# EasyEDA Pro project ProPrj_承载我所有幻想的键盘_2025-02-09.epro, schematic 01-Schematic, sheets 5 to 8 of 8

## Sheets
5 USB: Create Date: 2024-07-29; Page Name: USB; Project Name: 火星号键盘V2; Schematic Name: 主控板_4; Update Date: 2024-07-29
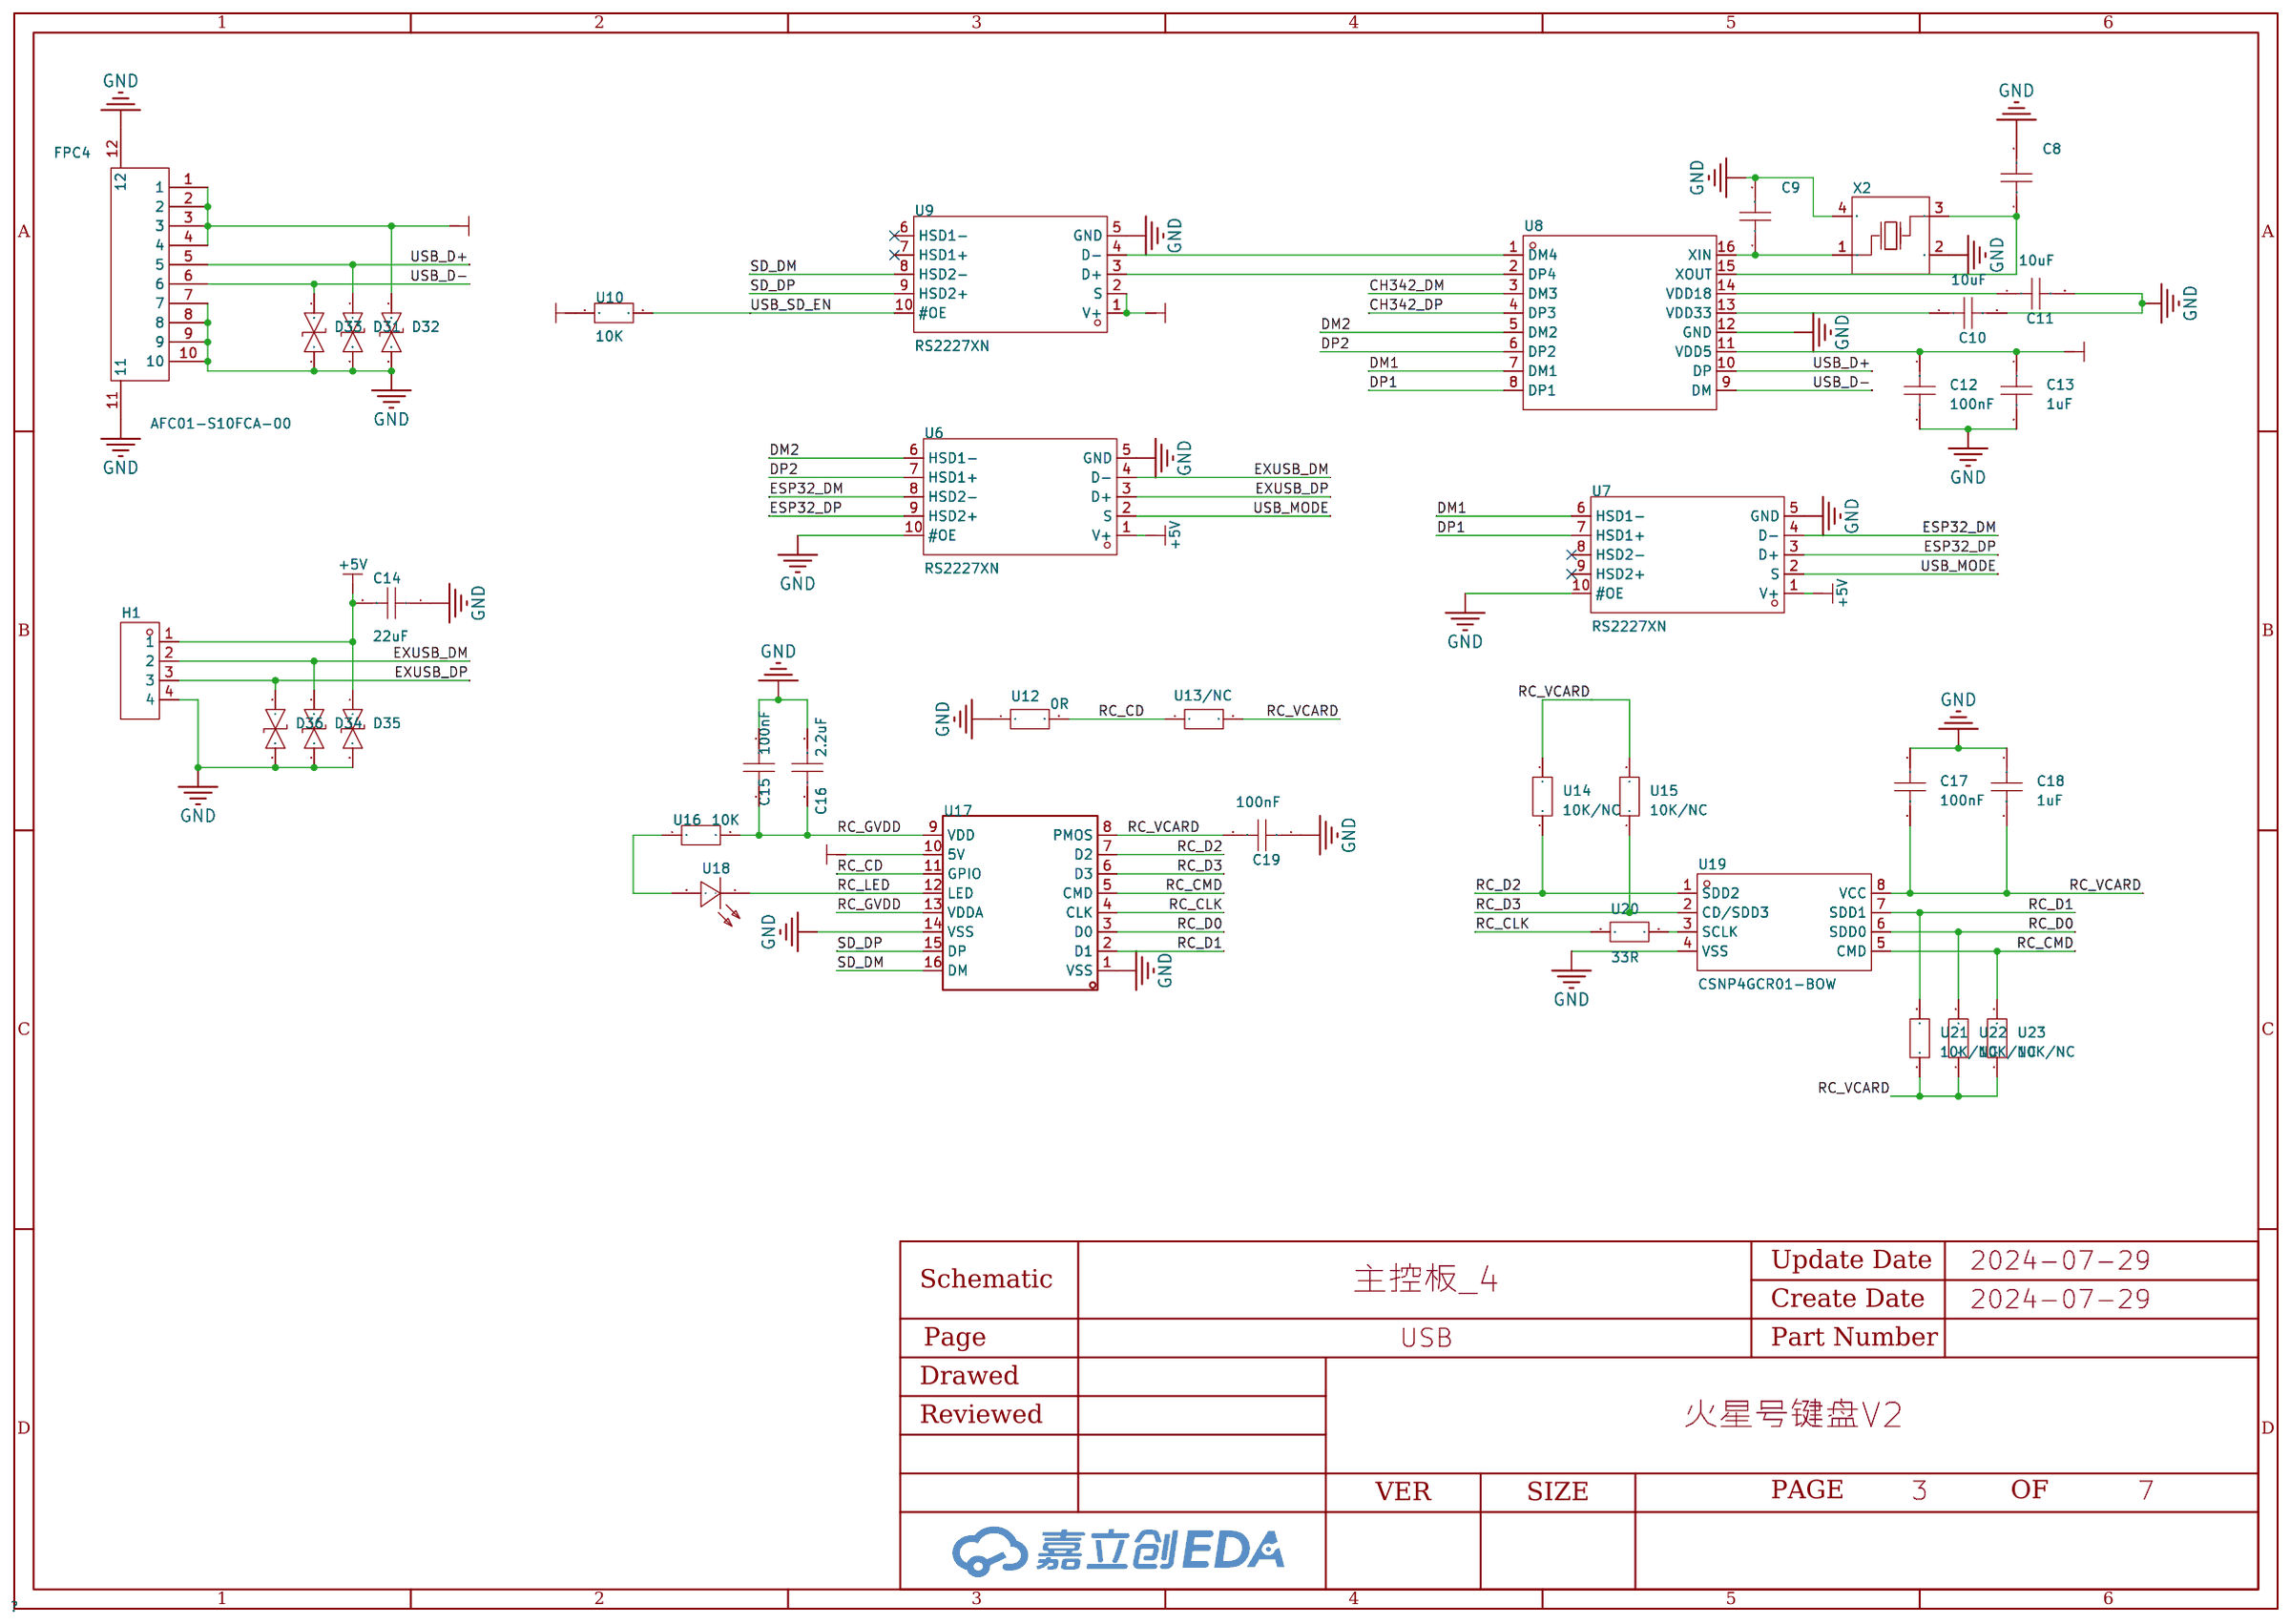
[diagram p4: USB]
6 电源: Create Date: 2024-07-29; Page Name: 电源; Project Name: 火星号键盘V2; Schematic Name: 主控板_4; Update Date: 2024-07-29
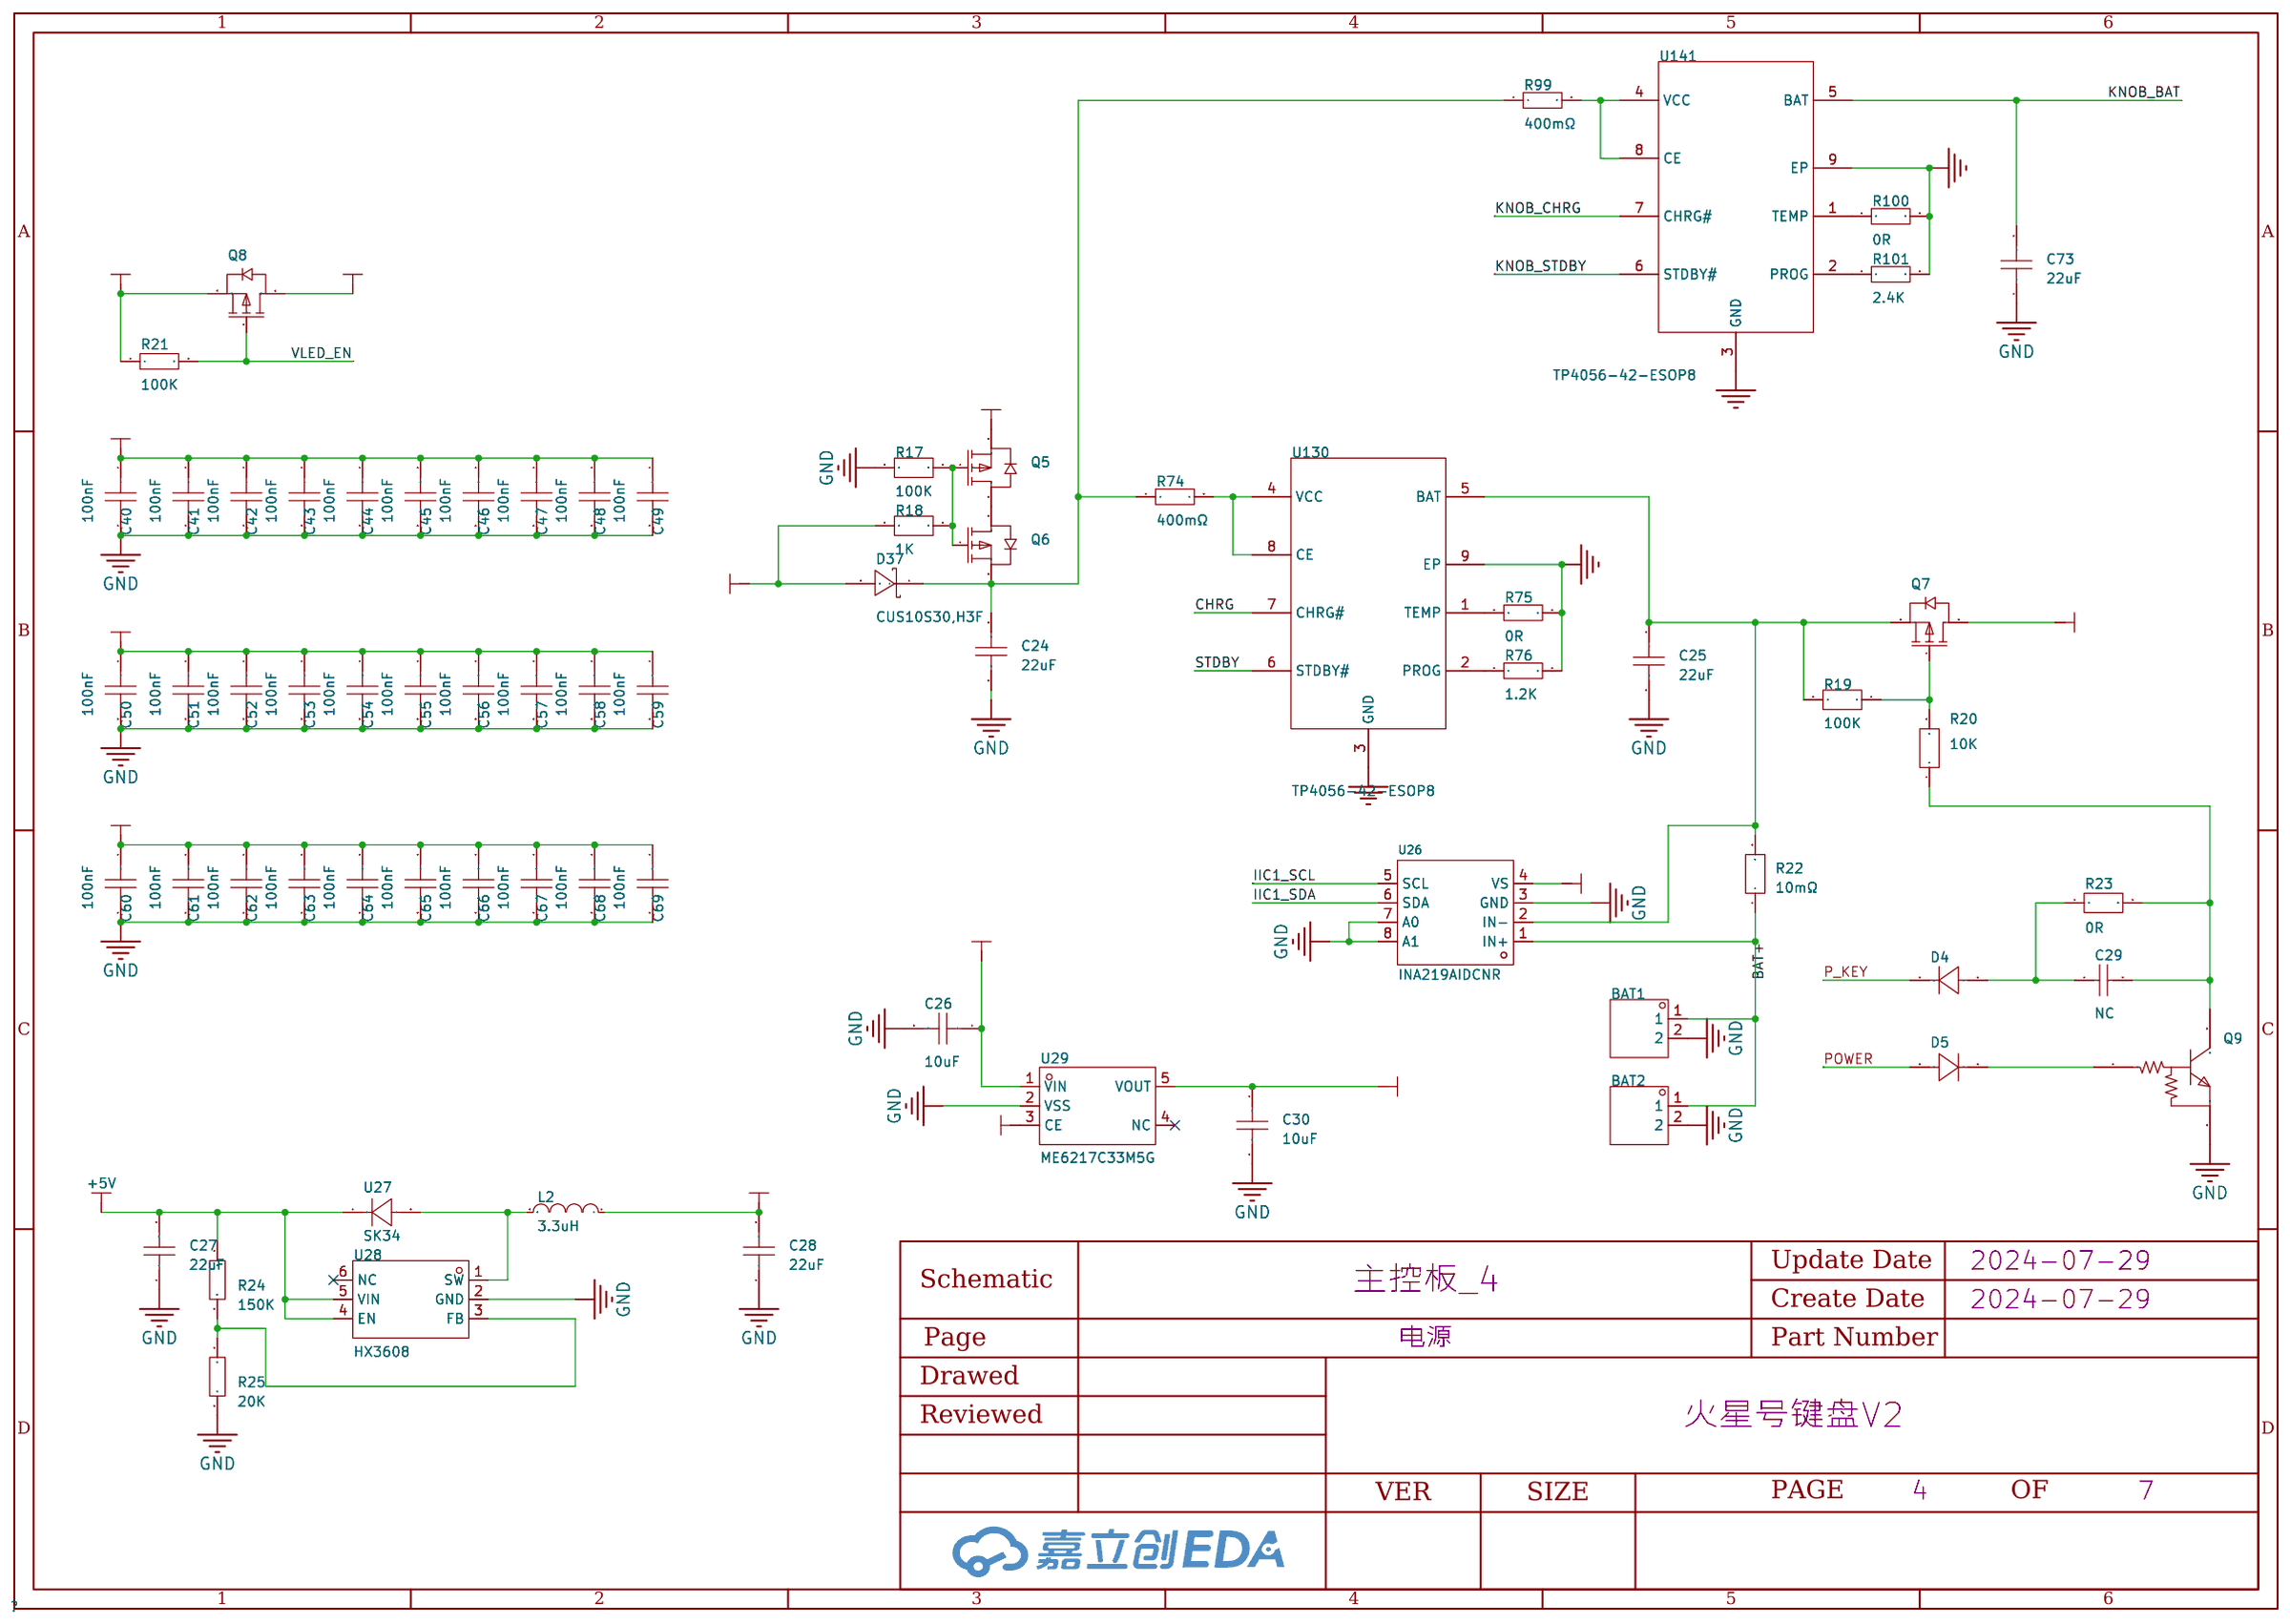
[diagram p5: 电源]
7 下载: Create Date: 2024-07-29; Page Name: 下载; Project Name: 火星号键盘V2; Schematic Name: 主控板_4; Update Date: 2024-07-29
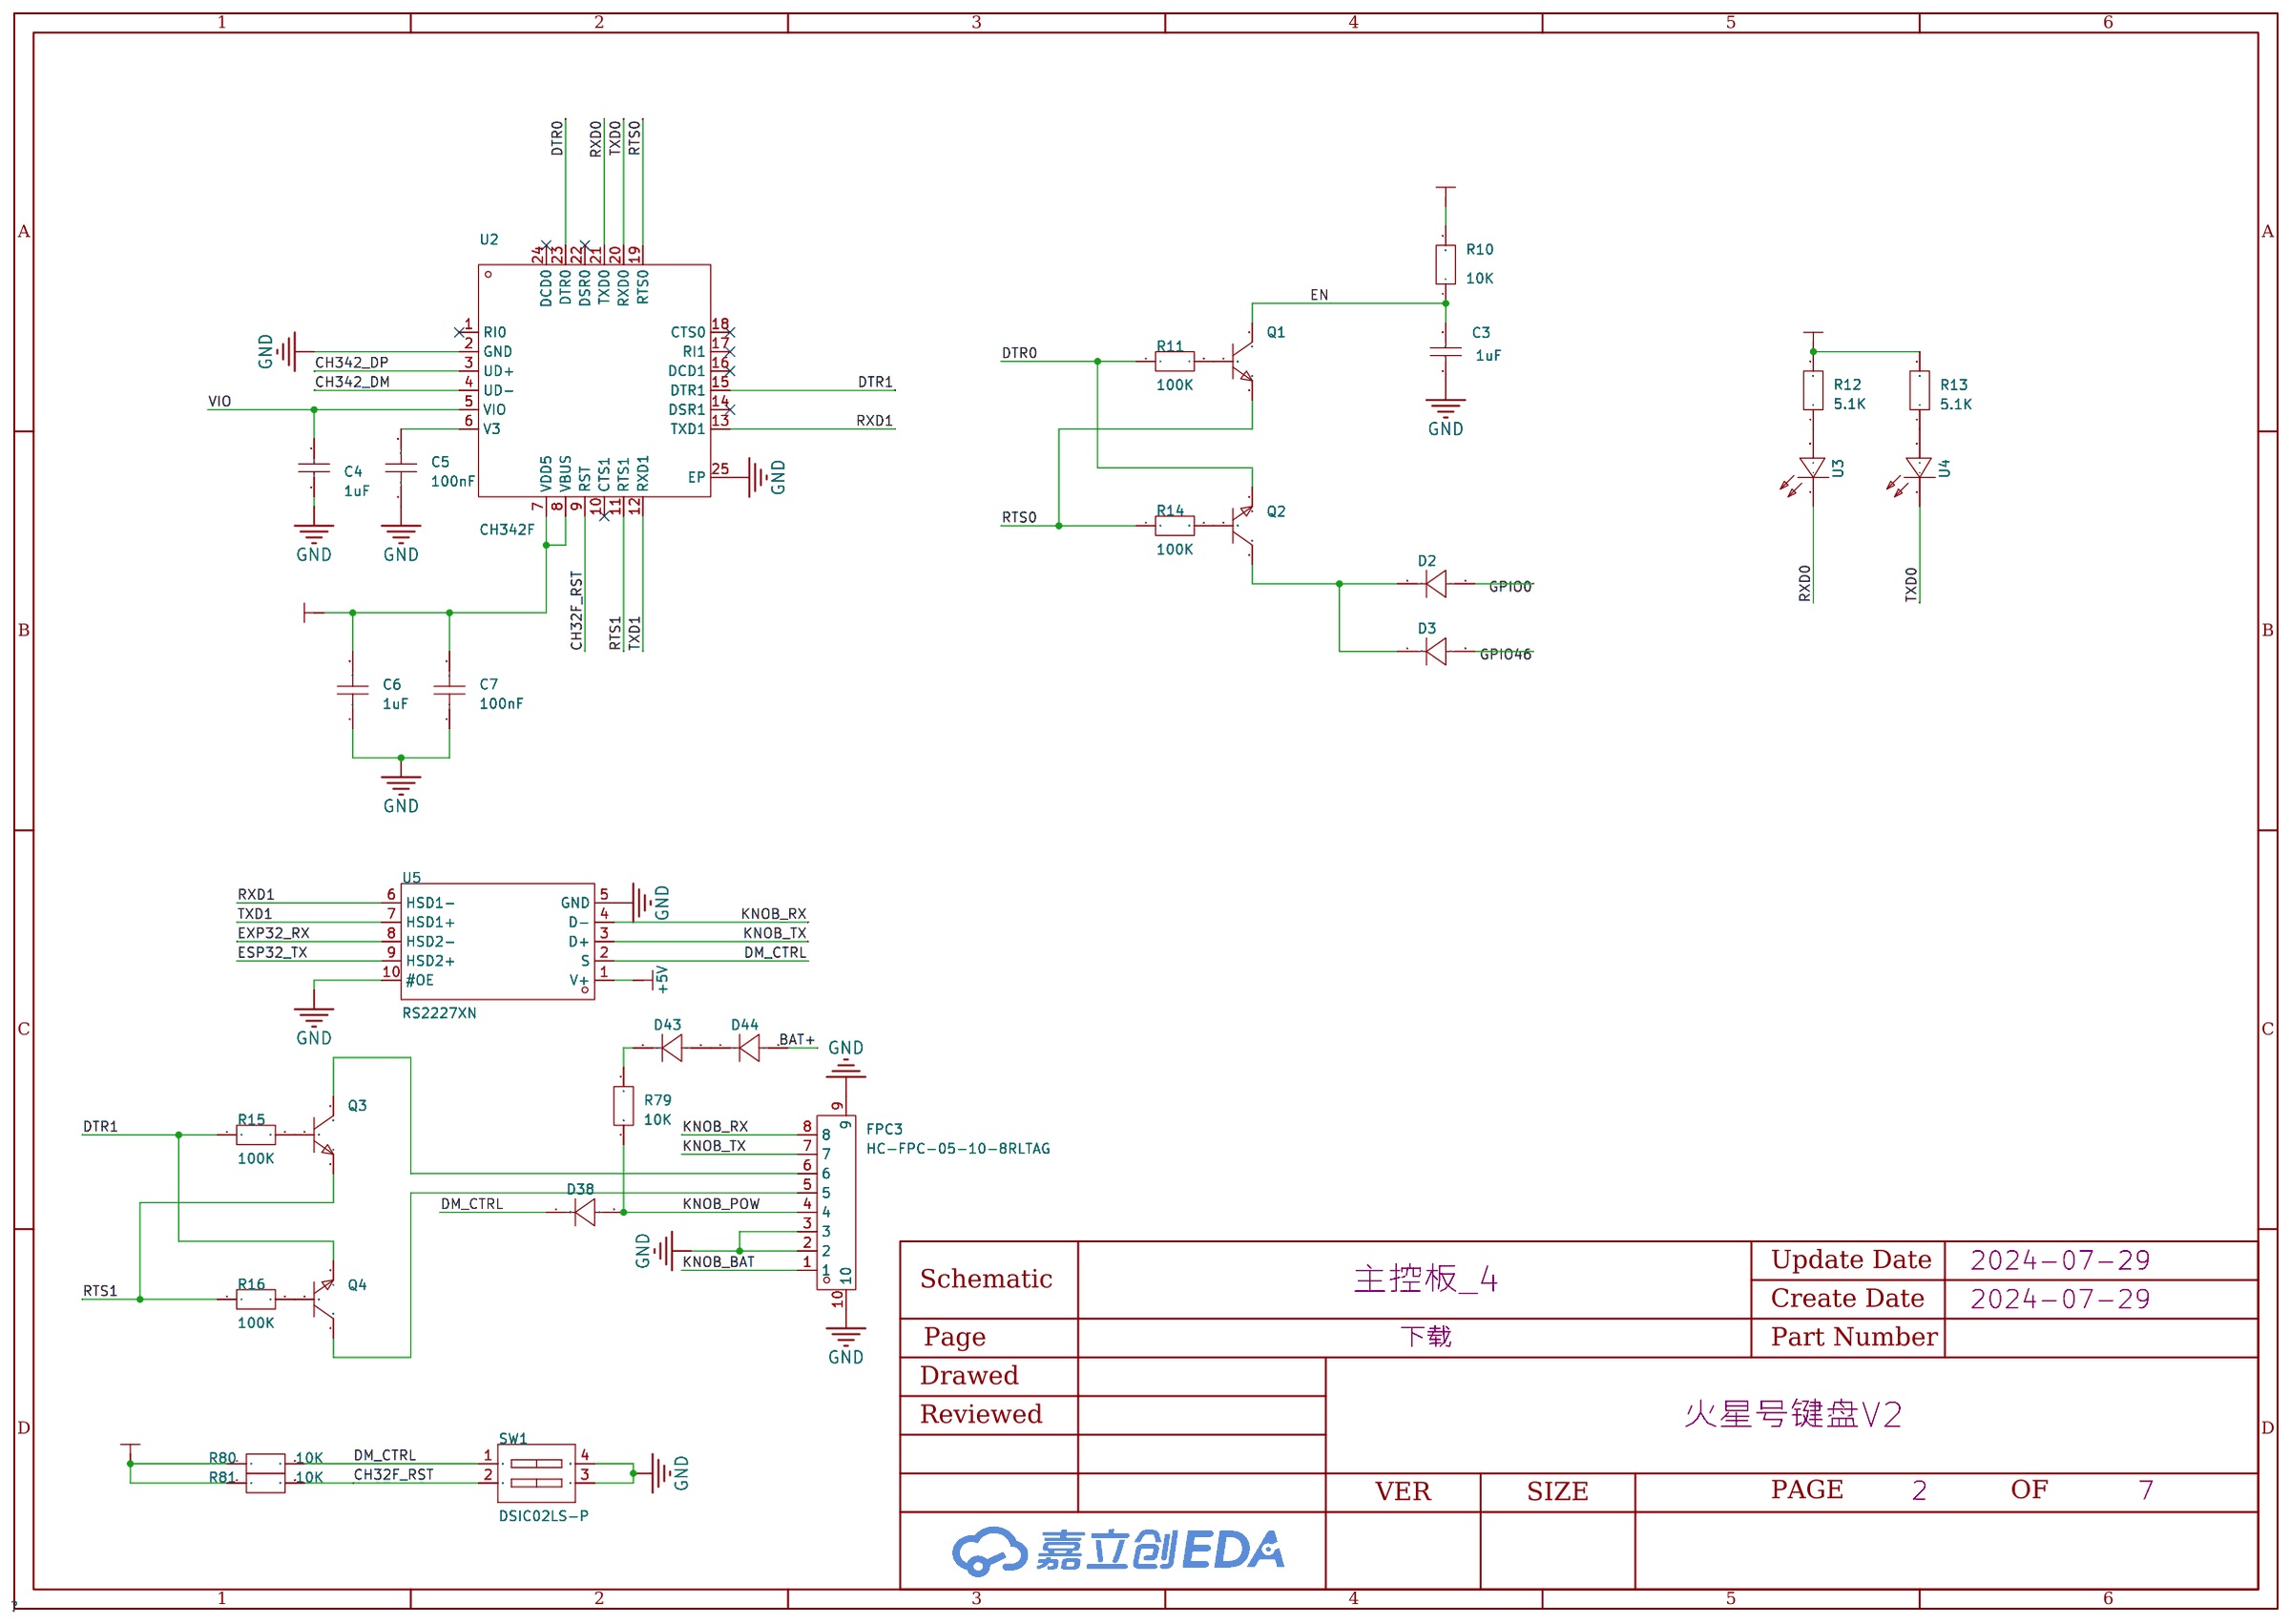
[diagram p6: 下载]
8 音频
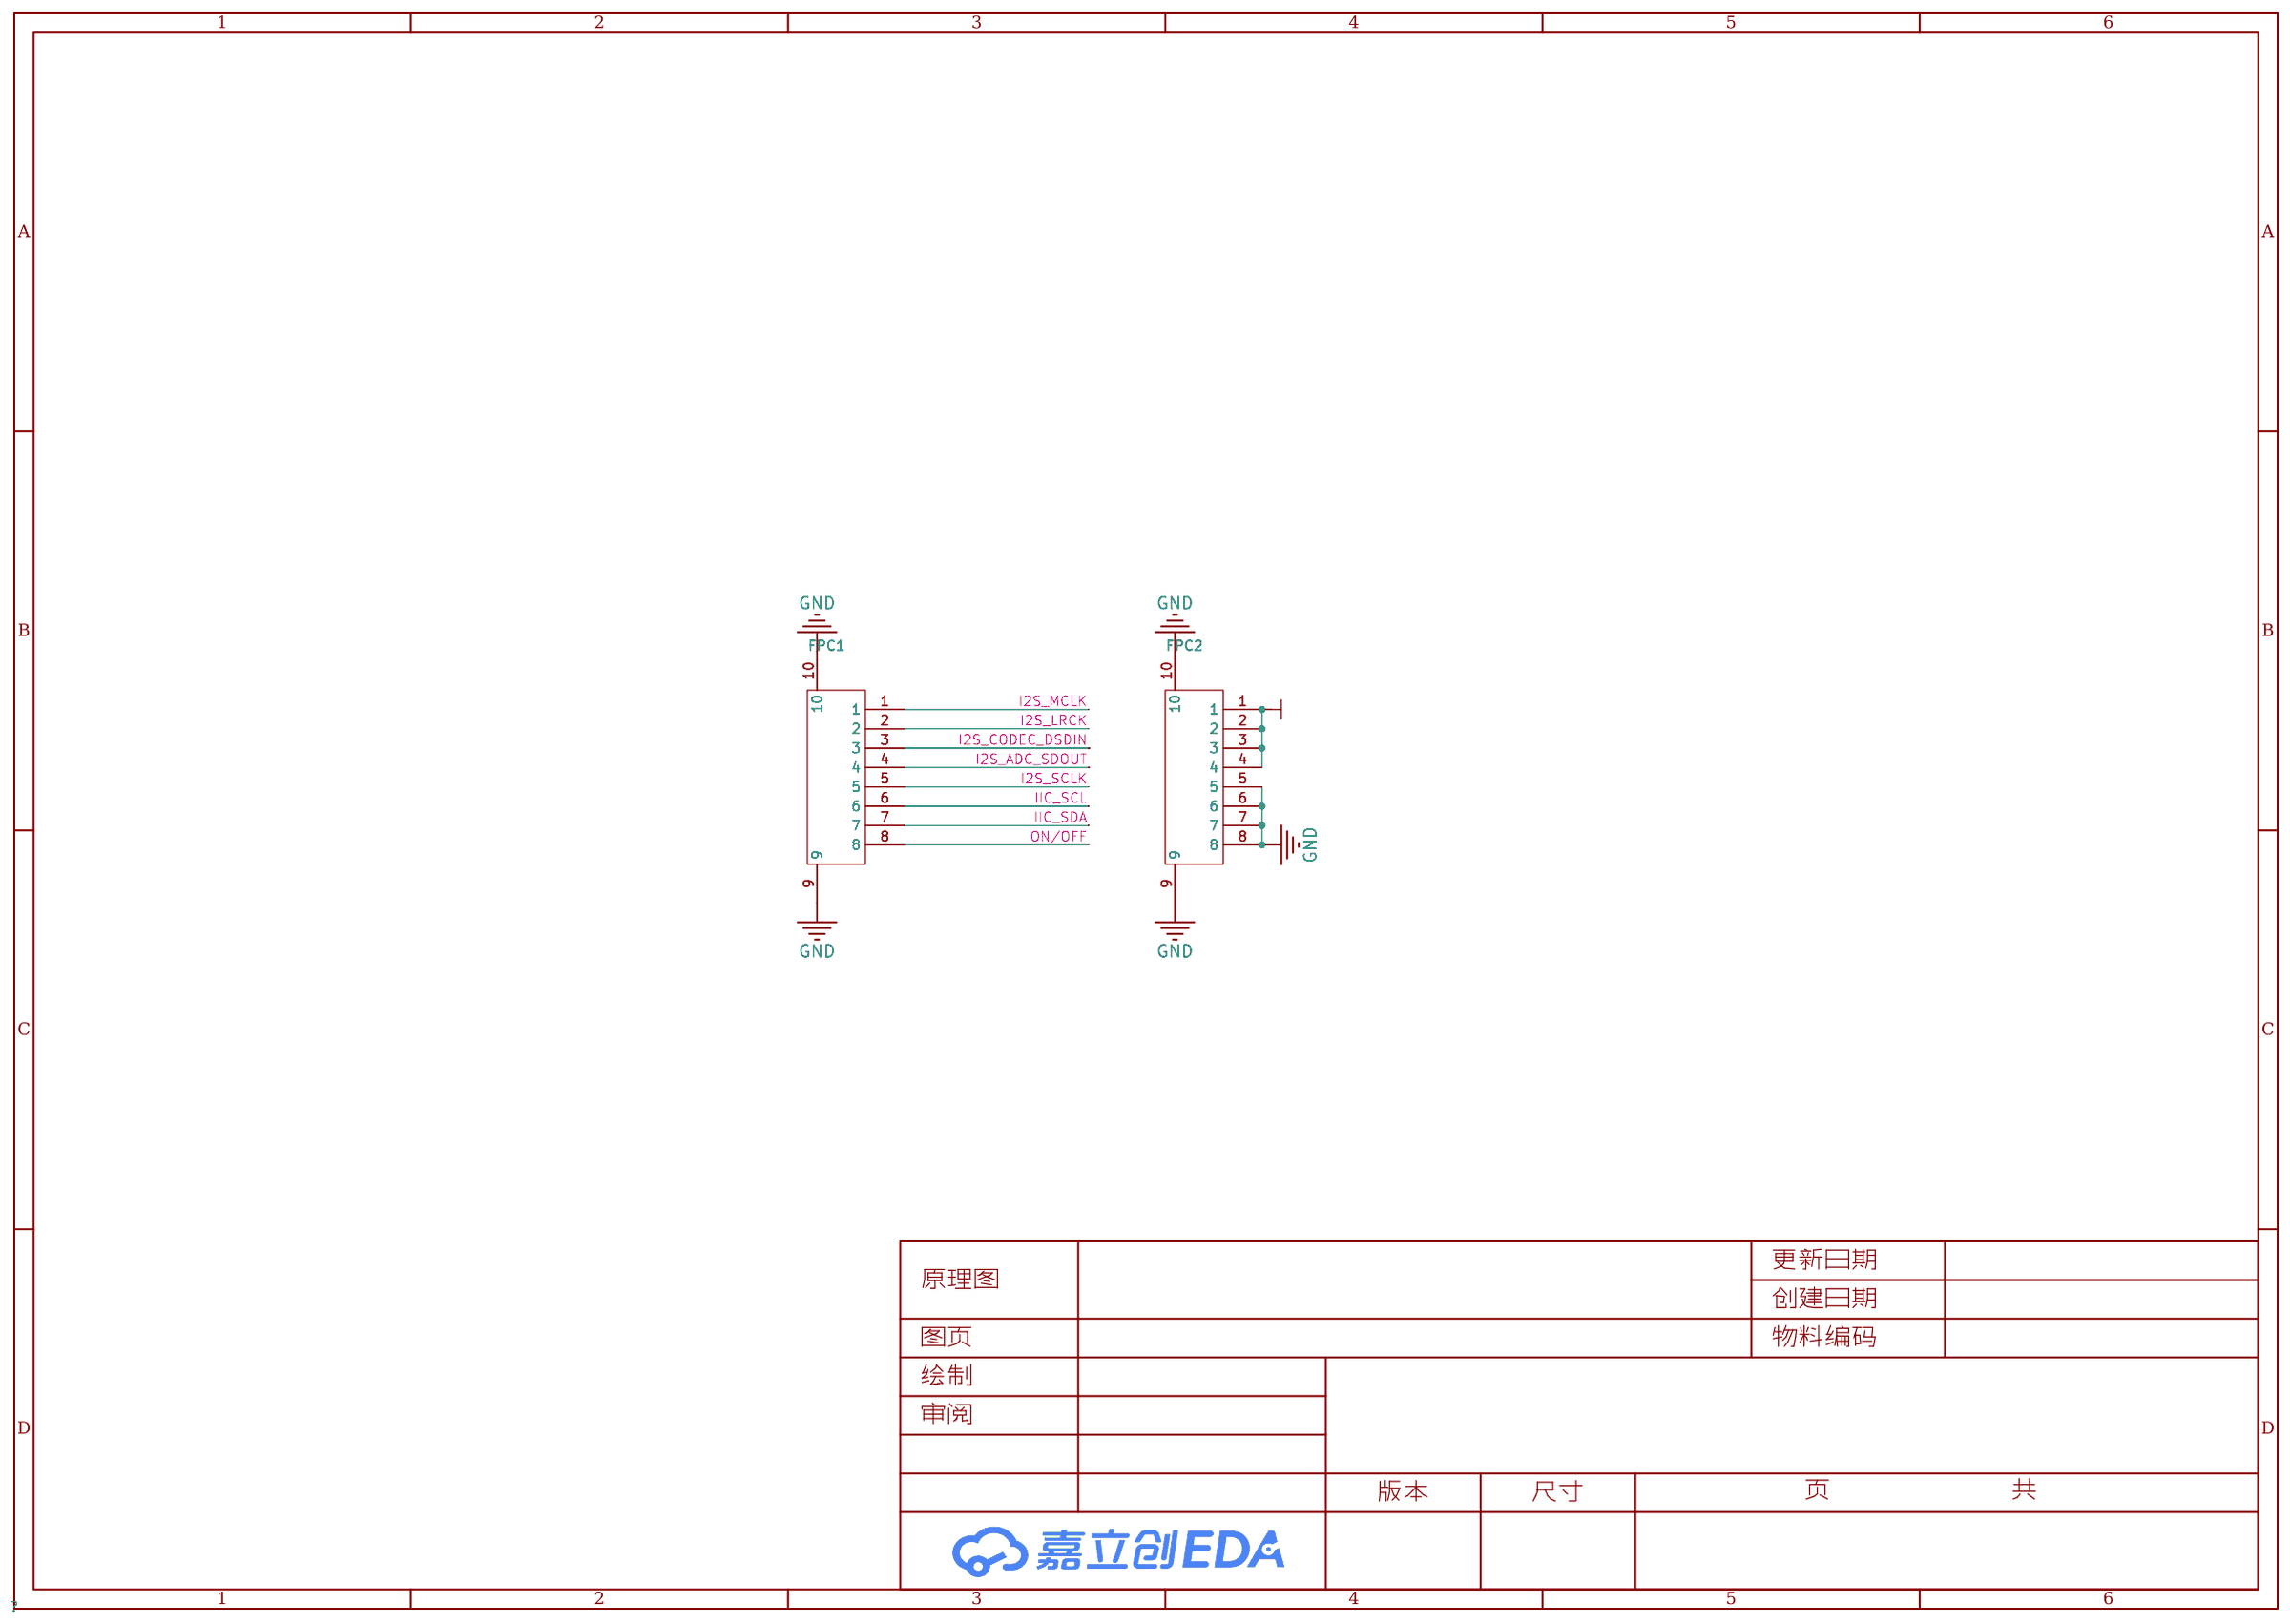
[diagram p7: 音频]

## Parts
sheet USB
C8  20pF  [C0402]
C9  20pF  [C0402]
C10  10uF  [C0402]
C11  10uF  [C0402]
C12  100nF  [C0402]
C13  100nF  [C0402]
C14  22uF  [C0805]
C15  100nF  [C0402]
C16  2.2uF  [C0402]
C17  100nF  [C0402]
C18  100nF  [C0402]
C19  100nF  [C0402]
D31  0603ESDA-05N  [D0603-BI]
D32  0603ESDA-05N  [D0603-BI]
D33  0603ESDA-05N  [D0603-BI]
D34  0603ESDA-05N  [D0603-BI]
D35  0603ESDA-05N  [D0603-BI]
D36  0603ESDA-05N  [D0603-BI]
FPC4  AFC01-S10FCA-00  [FPC-SMD_P0.5-10P_FGS-XJ-H2.0]
H1  -  [HDR-TH_4P-P2.54-V-M]
U6  RS2227XN  [MSOP-10_L3.0-W3.0-P0.50-LS5.0-BL]
U7  RS2227XN  [MSOP-10_L3.0-W3.0-P0.50-LS5.0-BL]
U8  SL2.1A  [SOP-16_L10.0-W3.9-P1.27-LS6.0-BL]
U9  RS2227XN  [MSOP-10_L3.0-W3.0-P0.50-LS5.0-BL]
U10  10K  [R0402]
U12  0R  [R0402]
U13/NC  10K  [R0402]
U14  10K/NC  [R0402]
U15  10K/NC  [R0402]
U16  10K  [R0402]
U17  GL823K  [SSOP-16_L4.9-W3.9-P0.64-LS6.0-BL]
U18  SML-LX0603SRW-TR  [LED0603-RD_RED]
U19  CSNP4GCR01-BOW  [LGA-8_L6.0-W8.0-P1.27-TL]
U20  33R  [R0402]
U21  10K/NC  [R0402]
U22  10K/NC  [R0402]
U23  10K/NC  [R0402]
X2  12MHz  [CRYSTAL-SMD_4P-L3.2-W2.5-BL]
sheet 下载
C3  1uF  [C0402]
C4  1uF  [C0402]
C5  100nF  [C0402]
C6  100nF  [C0402]
C7  100nF  [C0402]
D2  1N4148WS  [SOD-323_L1.8-W1.3-LS2.5-RD]
D3  1N4148WS  [SOD-323_L1.8-W1.3-LS2.5-RD]
D38  1N4148WS  [SOD-323_L1.8-W1.3-LS2.5-RD]
D43  1N4148WS  [SOD-323_L1.8-W1.3-LS2.5-RD]
D44  1N4148WS  [SOD-323_L1.8-W1.3-LS2.5-RD]
FPC3  HC-FPC-05-10-8RLTAG  [FPC-SMD_8P-P0.50_HCTL_HC-FPC-05-10-8RLTAG]
Q1  S8050  [SOT-23-3_L2.9-W1.3-P1.90-LS2.4-BR]
Q2  S8050  [SOT-23-3_L2.9-W1.3-P1.90-LS2.4-BR]
Q3  S8050  [SOT-23-3_L2.9-W1.3-P1.90-LS2.4-BR]
Q4  S8050  [SOT-23-3_L2.9-W1.3-P1.90-LS2.4-BR]
R10  10K  [R0402]
R11  100K  [R0402]
R12  5.1K  [R0402]
R13  5.1K  [R0402]
R14  100K  [R0402]
R15  100K  [R0402]
R16  100K  [R0402]
R79  10K  [R0402]
R80  10K  [R0402]
R81  10K  [R0402]
SW1  DSIC02LS-P  [SW-SMD_4P-L5.1-W6.1-P2.54-LS9.8]
U2  CH342F  [VQFN-24_L4.0-W4.0-P0.50-TL-EP2.4]
U3  SML-LX0603SRW-TR  [LED0603-RD_RED]
U4  SML-LX0603SRW-TR  [LED0603-RD_RED]
U5  RS2227XN  [MSOP-10_L3.0-W3.0-P0.50-LS5.0-BL]
sheet 电源
BAT1  -  [HDR-TH_2P-P2.54-V-M-1]
BAT2  -  [HDR-TH_2P-P2.54-V-M-1]
C24  22uF  [C0603]
C25  22uF  [C0603]
C26  10uF  [C0402]
C27  22uF  [C0603]
C28  22uF  [C0603]
C29  1uF  [C0603]
C30  10uF  [C0402]
C40  100nF  [C0402]
C41  100nF  [C0402]
C42  100nF  [C0402]
C43  100nF  [C0402]
C44  100nF  [C0402]
C45  100nF  [C0402]
C46  100nF  [C0402]
C47  100nF  [C0402]
C48  100nF  [C0402]
C49  100nF  [C0402]
C50  100nF  [C0402]
C51  100nF  [C0402]
C52  100nF  [C0402]
C53  100nF  [C0402]
C54  100nF  [C0402]
C55  100nF  [C0402]
C56  100nF  [C0402]
C57  100nF  [C0402]
C58  100nF  [C0402]
C59  100nF  [C0402]
C60  100nF  [C0402]
C61  100nF  [C0402]
C62  100nF  [C0402]
C63  100nF  [C0402]
C64  100nF  [C0402]
C65  100nF  [C0402]
C66  100nF  [C0402]
C67  100nF  [C0402]
C68  100nF  [C0402]
C69  100nF  [C0402]
C73  22uF  [C0603]
D4  1N4148WS  [SOD-323_L1.8-W1.3-LS2.5-RD]
D5  1N4148WS  [SOD-323_L1.8-W1.3-LS2.5-RD]
D37  CUS10S30,H3F  [SOD-323_L1.8-W1.3-LS2.5-RD]
L2  3.3uH  [IND-SMD_L4.4-W4.2-A]
Q5  3401  [SOT-23-3_L2.9-W1.3-P1.90-LS2.4-BR]
Q6  3401  [SOT-23-3_L2.9-W1.3-P1.90-LS2.4-BR]
Q7  3401  [SOT-23-3_L2.9-W1.3-P1.90-LS2.4-BR]
Q8  3401  [SOT-23-3_L2.9-W1.3-P1.90-LS2.4-BR]
Q9  LMUN2212LT1G  [SOT-23-3_L2.9-W1.3-P1.90-LS2.4-BR]
R17  100K  [R0603]
R18  1K  [R0603]
R19  100K  [R0603]
R20  10K  [R0603]
R21  100K  [R0603]
R22  10mΩ  [R1206]
R23  0R  [R0603]
R24  150K  [R0603]
R25  20K  [R0603]
R74  400mΩ  [R2010]
R75  0R  [R0603]
R76  1.2K  [R0603]
R99  400mΩ  [R2010]
R100  0R  [R0603]
R101  2.4K  [R0603]
U26  INA219AIDCNR  [SOT-23-8_L3.0-W1.7-P0.65-LS2.8-BR]
U27  SK34  [SMA_L4.3-W2.6-LS5.1-RD]
U28  HX3608  [SOT-23-6_L2.9-W1.6-P0.95-LS2.8-BR]
U29  ME6217C33M5G  [SOT-23-5_L3.0-W1.7-P0.95-LS2.8-BR]
U130  TP4056-42-ESOP8  [ESOP-8_L4.9-W3.9-P1.27-LS6.0-BL-EP]
U141  TP4056-42-ESOP8  [ESOP-8_L4.9-W3.9-P1.27-LS6.0-BL-EP]
sheet 音频
FPC1  -  [FPC-SMD_P0.50-8P_FGS-XJ-H2.0]
FPC2  -  [FPC-SMD_P0.50-8P_FGS-XJ-H2.0]

## Library data of the parts
C8 C9 = GCM1555C1H200JA16D: 容值:20pF;精度:±5%;额定电压:-;材质(温度系数):-;; LCSC Part Name: 20pF ±5%; Supplier Part: C343868; Manufacturer: muRata(村田); Supplier Footprint: 0402; JLCPCB Part Class: Extended Part; Datasheet: https://atta.szlcsc.com/upload/public/pdf/source/20200713/C701256_2542DCDD70722D2BE0CCE4799A0421BC.pdf; Supplier: LCSC; Tolerance: ±5%
C10 C11 C26 C30 = CL05A106MP5NUNC: 容值:10uF;精度:±20%;额定电压:10V;材质(温度系数):X5R;; LCSC Part Name: 10uF ±20% 10V; Supplier Part: C315248; Manufacturer: SAMSUNG(三星); Supplier Footprint: 0402; JLCPCB Part Class: Extended Part; Datasheet: https://atta.szlcsc.com/upload/public/pdf/source/20200102/C478861_C4302703595930F3C0E62DAD3349F1AA.pdf; Supplier: LCSC; Tolerance: ±20%; Voltage Rated: 10V; Temperature Coefficient: X5R
C5-C7 C12 C13 C15 C17-C19 C40-C69 = GCM155R71C104KA55J: 容值:100nF;精度:±10%;额定电压:-;材质(温度系数):-;; LCSC Part Name: 100nF ±10%; Supplier Part: C2655418; Manufacturer: muRata(村田); Supplier Footprint: 0402; JLCPCB Part Class: 扩展库; Datasheet: https://atta.szlcsc.com/upload/public/pdf/source/20210701/42090801FDE37D0E45AFF657247F4A08.pdf; Supplier: LCSC; Tolerance: ±10%
C14 = GRM21BZ71A226ME15L: 容值:22uF;精度:±20%;额定电压:-;材质(温度系数):-;; LCSC Part Name: 22uF ±20%; Supplier Part: C907991; Manufacturer: muRata(村田); Supplier Footprint: 0805; JLCPCB Part Class: 扩展库; Datasheet: https://atta.szlcsc.com/upload/public/pdf/source/20201022/C907991_FDD26F97C89A3C2FF3DDCDE25DF37A4B.pdf; Supplier: LCSC; Tolerance: ±20%
C16 = 0402X225M6R3CT: 温度系数:X5R;额定电压:6.3V;容值:2.2uF;电容体长:-;电容体宽:-;电容体厚度:-;精度:±20%;; LCSC Part Name: 2.2uF ±20% 6.3V; Supplier Part: C295944; Manufacturer: Walsin(华新科); Supplier Footprint: 0402; JLCPCB Part Class: Extended Part; Datasheet: https://atta.szlcsc.com/upload/public/pdf/source/20180926/C295944_83E46F3CE40F59B316DD508BCCE2E263.pdf; Supplier: LCSC; Temperature Coefficient: X5R; Voltage Rated: 6.3V; Tolerance: ±20%
D31-D36 = 0603ESDA-05N: 极性:双向;反向截止电压(Vrwm):5V;最大钳位电压:50V;; LCSC Part Name: 双向ESD; Supplier Part: C316054; Manufacturer: BORN(伯恩半导体); Supplier Footprint: 0603; JLCPCB Part Class: 扩展库; Datasheet: https://atta.szlcsc.com/upload/public/pdf/source/20200528/C316054_1CC523E9CE69E41C8DD5A05C832CCD1A.pdf; Supplier: LCSC; polarity: 双向; Reverse Stand-Off Voltage (Vrwm): 5V; Maximum Clamping Voltage: 50V; Type: ESD
FPC4 = AFC01-S10FCA-00: 锁定特性:翻盖式;触点类型:下接;触点数量:10P;间距:0.5mm;安装类型:卧贴;; LCSC Part Name: 间距:0.5mm P数:10P 翻盖式 下接; Supplier Part: C262659; Manufacturer: JS(钜硕电子); Supplier Footprint: SMD,P=0.5mm,卧贴; JLCPCB Part Class: 扩展库; Datasheet: https://atta.szlcsc.com/upload/public/pdf/source/20190816/C413942_2A72D1AC756EAE17EEDF756A339D4500.pdf; Supplier: LCSC; Locking Feature: 翻盖式; Contact Type: 下接; Number of Contacts: 10P; Pitch: 0.5mm; Mounting Type: 卧贴; FFC, FCB Thickness: 0.3mm; Height Above Board: 2mm
H1 = HDR-M_2.54_1x4P: Supplier Part: C492403; Supplier Footprint: 插件
U5-U7 U9 = RS2227XN: 开关电路:-;多路复用器/解复用器电路:-;导通电阻（最大值）:-;开关电压（最大值）:-;; LCSC Part Name: 模拟开关RS2227XN; Supplier Part: C255478; Manufacturer: RUNIC(润石); Supplier Footprint: MSOP-10; JLCPCB Part Class: 扩展库; Datasheet: https://atta.szlcsc.com/upload/public/pdf/watermark/20190926/C255478_D49089ECE2A541195D1EEBCAD82CD8F3.pdf; Supplier: LCSC
U8 = SL2.1A: Pin Type: IN; Supplier: LCSC; Supplier Part: C192893; Manufacturer: CoreChips; JLCPCB Part Class: Extended Part
U10 U12 U13/NC U14-U16 U20-U23 = 0402: Supplier Part: C9900015844; JLCPCB Part Class: 扩展库; Datasheet: https://atta.szlcsc.comnull; Supplier: LCSC
U17 = GL823K-HCY04: link: https://item.szlcsc.com/403588.html; 3DModel: SSOP-16_L4.9-W3.9-H1.75-LS6.0_P0.64; Supplier: LCSC; Supplier Part: C284879; Manufacturer: Genesys Logic; JLCPCB Part Class: Extended Part
U3 U4 U18 = SML-LX0603SRW-TR: Supplier Part: C9900013322; Supplier Footprint: LED_0603; JLCPCB Part Class: Extended Part; Datasheet: https://atta.szlcsc.comnull; Supplier: LCSC
U19 = CSNP4GCR01-BOW: 免驱动使用，标准SDIO接口，兼容SPI/SD/eMMC接口，兼容各大MCU平台;内置EDC/ECC，坏块管理，垃圾回收算法;可机贴，锁定晶圆和控制器,一致性高；内置SLC晶圆,10W次擦写寿命，通过1万次随机掉电测试，支持工业级温度-40°~+85°。 CS(创世) SD NAND也被很多开发者朋友称为：贴片式TF卡，贴片式SD卡，贴片卡，焊接式SD卡，焊接式TF卡，工业级TF卡，工业级SD卡，嵌入式SD卡等。主要解决了主控(比如STM32系列的MCU单片机 )使用 SLC NAND FLASH,SPI; LCSC Part Name: 4Gb SD NAND 一代; Supplier Part: C2691595; Manufacturer: CS(创世); Supplier Footprint: LGA8-6*8mm; JLCPCB Part Class: 扩展库; Datasheet: https://atta.szlcsc.com/upload/public/pdf/source/20210222/C2691595_CEF59AF255D4BCF0036858007B04A3F9.pdf; Supplier: LCSC
X2 = TAXM12M4RLBDDT2T: 晶振类型:SMD 谐振器;频率:12MHz;频率公差:±10ppm;频率稳定度:±20ppm;负载电容:20pF;等效串联电阻(ESR):50Ω;工作温度:-;; LCSC Part Name: 12MHz ±10ppm 20pF; Supplier Part: C133334; Manufacturer: TAE(雅晶鑫); Supplier Footprint: SMD3225-4P; JLCPCB Part Class: 扩展库; Datasheet: https://atta.szlcsc.com/upload/public/pdf/source/20210910/A862C74DCD1FE9853DDB17F72A491972.pdf; Supplier: LCSC; Crystal Type: SMD 谐振器; Frequency Tolerance: ±10ppm; Frequency Stability: ±20ppm; Load Capacitance: 20pF; Equivalent Series Resistance (ESR): 50Ω
C3 C4 = 0402B105K100NT: 温度系数:X7R;精度:±10%;额定电压:10V;容值:1uF;; LCSC Part Name: 1uF(105) ±10% 10V 停产; Supplier Part: C1526; Manufacturer: FH(风华); Supplier Footprint: 0402; JLCPCB Part Class: 扩展库; Datasheet: https://atta.szlcsc.com/upload/public/pdf/source/20170923/C1526_1506149256027988333.pdf; Supplier: LCSC; Temperature Coefficient: X7R; Tolerance: ±10%; Voltage Rated: 10V
D2-D5 D38 D43 D44 = 1N4148WS_C727111: 二极管配置:独立式;功率:400mW;直流反向耐压(Vr):100V;平均整流电流(Io):300mA;正向压降(Vf):1.25V@150mA;反向电流(Ir):1A@75V;反向恢复时间(trr):8ns;工作温度:-55~+150@(Tj);; LCSC Part Name: 100V 300mA 8ns; Supplier Part: C727111; Manufacturer: TWGMC(台湾迪嘉); Supplier Footprint: SOD-323; JLCPCB Part Class: Extended Part; Datasheet: https://atta.szlcsc.com/upload/public/pdf/source/20200828/C727111_E7108F014A9288D320E3440593CCDF54.pdf; Supplier: LCSC; Diode Configuration: 独立式; Power Dissipation: 400mW; Reverse Voltage (Vr): 100V; Average Rectified Current (Io): 300mA; Forward Voltage (Vf@If): 1.25V@150mA; Reverse Leakage Current: 1A@75V; Reverse Recovery Time (trr): 8ns; Operating Temperature: -55~+150@(Tj)
FPC3 = HC-FPC-05-10-8RLTAG: 锁定特性:翻盖式;触点类型:下接;触点数量:8P;间距:0.5mm;安装类型:卧贴;工作温度范围:-55℃~+85℃;; LCSC Part Name: 翻盖式 下接 P数:8P 间距:0.5mm; Supplier Part: C5213730; Manufacturer: HCTL(华灿天禄); Supplier Footprint: SMD,P=0.5mm,卧贴; JLCPCB Part Class: 扩展库; Datasheet: https://atta.szlcsc.com/upload/public/pdf/source/20221027/B2DE489DA152049D1F105170189CFB4E.pdf; Supplier: LCSC; Locking Feature: 翻盖式; Contact Type: 下接; Number of Contacts: 8P; Pitch: 0.5mm; Mounting Type: 卧贴; FFC, FCB Thickness: 0.3mm; Height Above Board: 1mm; Contact Material: 铜合金; Operating Temperature Range: -55℃~+85℃
Q1-Q4 = S8050: 晶体管类型:NPN;集射极击穿电压(Vceo):25V;集电极电流(Ic):500mA;功率(Pd):300mW;集电极-发射极饱和电压(VCE(sat)@Ic,Ib):600mV@500mA,50mA;直流电流增益(hFE@Ic,Vce):-;特征频率(fT):150MHz;工作温度:+150@(Tj);; LCSC Part Name: NPN 25V 500mA; Supplier Part: C908252; Manufacturer: FUXINSEMI(富芯森美); Supplier Footprint: SOT-23; JLCPCB Part Class: Extended Part; Datasheet: https://atta.szlcsc.com/upload/public/pdf/source/20201027/C908252_C84D7FD657294F1E5C16426DD030E979.pdf; Supplier: LCSC; Transistor Type: NPN; Collector-Emitter Breakdown Voltage (Vceo): 25V; Collector Current (Ic): 500mA; Power Dissipation (Pd): 300mW; Collector-Emitter Saturation Voltage (VCE(sat)@Ic,Ib): 600mV@500mA,50mA; Transition Frequency (fT): 150MHz; Operating Temperature: +150@(Tj)
R10-R16 R79-R81 = SCR0402J10K: Supplier Part: C3017497; Manufacturer: VO(翔胜); Supplier Footprint: 0402; JLCPCB Part Class: 扩展库; Datasheet: https://atta.szlcsc.com/upload/public/pdf/source/20220513/247AF9639BA21CF93567DC289CCC6A22.pdf; Supplier: LCSC
SW1 = DSIC02LS-P_C489174: 类型:平拨,凸起式;电路结构:单刀单掷;开关位数:2位;额定电流:25mA;额定电压:24V;使用寿命:3千次;颜色:黑色;; LCSC Part Name: 间距2.54mm 平拨,凸起式 2位拨码开关; Supplier Part: C489174; Manufacturer: XKB Connectivity(中国星坤); Supplier Footprint: SMD-4P,5.1x6.1mm; JLCPCB Part Class: 扩展库; Datasheet: https://atta.szlcsc.com/upload/public/pdf/source/20200227/C424380_7B5FE7C891E0521A8B96890FFC9096F0.pdf; Supplier: LCSC; Type: 平拨,凸起式; Circuit: 单刀单掷; Number of Positions: 2位; Pin Style: 鸥翼型; Lead Pitch: 2.54mm; Current Rating: 25mA; Voltage Rating: 24V; Operating Temperature: -20℃~+70℃; Operating Life: 3千次; Color: 黑色
U2 = CH342F: Supplier Part: C2841530; Manufacturer: WCH(南京沁恒); Supplier Footprint: QFN24_4X4; JLCPCB Part Class: 扩展库; Datasheet: https://atta.szlcsc.com/upload/public/pdf/source/20211010/C2841530_D42D355CB13BEB69D3F27EE40180C477.pdf; Supplier: LCSC
BAT1 BAT2 = HDR-M_2.54_1x2P: Supplier Part: C124375; Supplier Footprint: 插件
C24 C25 C27 C28 C73 = CAP_0603: Supplier Footprint: 0603
C29 = 0603F105M160NT: 容值:1uF;精度:±20%;额定电压:16V;材质(温度系数):Y5V;; LCSC Part Name: 1uF ±20% 16V; Supplier Part: C1689; Manufacturer: FH(风华); Supplier Footprint: 0603; JLCPCB Part Class: Extended Part; Datasheet: https://atta.szlcsc.com/upload/public/pdf/source/20170923/C1689_1506149319442988473.pdf; Supplier: LCSC; Tolerance: ±20%; Voltage Rated: 16V; Temperature Coefficient: Y5V
D37 = CUS10S30,H3F: 正向压降(Vf):230mV@100mA;直流反向耐压(Vr):30V;平均整流电流(Io):1A;; LCSC Part Name: 电压:30V 电流:1A; Supplier Part: C146335; Manufacturer: TOSHIBA(东芝); Supplier Footprint: SC-76(SOD-323); Datasheet: https://atta.szlcsc.com/upload/public/pdf/source/20171211/C146335_15129763734771175369.pdf; Supplier: LCSC; Forward Voltage (Vf@If): 230mV@100mA; Reverse Voltage (Vr): 30V; Average Rectified Current (Io): 1A; Reverse Leakage Current (Ir): 500uA@30V
L2 = FXL0420-3R3-M: 电感值:3.3uH;精度:±20%;额定电流:3.3A;饱和电流(Isat):4A;类型:一体成型电感;; LCSC Part Name: 3.3uH ±20% 4A; Supplier Part: C167207; Manufacturer: cjiang(长江微电); Supplier Footprint: SMD,4.2x4.4mm; JLCPCB Part Class: 扩展库; Datasheet: https://atta.szlcsc.com/upload/public/pdf/source/20230516/FBADA9890E7FBE97C620F1D8B562D733.pdf; Supplier: LCSC; Tolerance: ±20%; Rated Current: 3.3A; Saturation Current (Isat): 4A; DC Resistance (DCR): 87mΩ; Type: 一体成型电感
Q5-Q8 = 3401_C239055: 类型:P沟道;漏源电压(Vdss):30V;连续漏极电流(Id):4.2A;功率(Pd):1.2W;导通电阻(RDS(on)@Vgs,Id):55mΩ@10V,4.2A;阈值电压(Vgs(th)@Id):1.3V@250A;; LCSC Part Name: P沟道 30V 4.2A; Supplier Part: C239055; Manufacturer: GOFORD(谷峰); Supplier Footprint: SOT-23(SOT-23-3); JLCPCB Part Class: Extended Part; Datasheet: https://atta.szlcsc.com/upload/public/pdf/source/20180619/C239055_DDCD8D435643D304BC40BD7DEC0BB420.pdf; Supplier: LCSC; Type: P沟道; Drain Source Voltage (Vdss): 30V; Continuous Drain Current (Id): 4.2A; Power Dissipation (Pd): 1.2W; Drain Source On Resistance (RDS(on)@Vgs,Id): 55mΩ@10V,4.2A; Gate Threshold Voltage (Vgs(th)@Id): 1.3V@250A
Q9 = LMUN2212LT1G: 晶体管类型:1个NPN-预偏置;功率(Pd):246mW;集电极电流(Ic):100mA;集射极击穿电压(Vceo):50V;; LCSC Part Name: 1个NPN-预偏置 100mA 50V; Supplier Part: C43984; Manufacturer: LRC(乐山无线电); Supplier Footprint: SOT-23(SOT-23-3); JLCPCB Part Class: Extended Part; Datasheet: https://atta.szlcsc.com/upload/public/pdf/source/20171014/C43984_15079757509251038527.pdf; Supplier: LCSC; Transistor Type: 1个NPN-预偏置; Power Dissipation (Pd): 246mW; Collector Current (Ic): 100mA; Collector-Emitter Breakdown Voltage (Vceo): 50V
R17-R20 = FRQ0603J104 TS: LCSC Part Name: 0603 ±5% 100K; Supplier Part: C2934392; Manufacturer: FOJAN(富捷); Supplier Footprint: 0603; Datasheet: https://atta.szlcsc.com/upload/public/pdf/source/20220510/440184775277A181327570BE5F6AE936.pdf; Supplier: LCSC
R21 R24 R25 R75 R76 R100 R101 = Res_0603: Supplier Footprint: 0603
R22 = HoLR1206-1W-10mR-1%-75ppm: 阻值:10mΩ;精度:±1%;功率:1W;; LCSC Part Name: 10mΩ ±1% 1W; Supplier Part: C601097; Manufacturer: Milliohm(毫欧); Supplier Footprint: 1206; JLCPCB Part Class: 扩展库; Datasheet: https://atta.szlcsc.com/upload/public/pdf/source/20200610/C601097_3C3A0FBF302E16C37BD368779C6D6328.pdf; Supplier: LCSC; Tolerance: ±1%; Power(Watts): 1W; Temperature Coefficient: ±75ppm/℃
R23 = ERJ3EKF2004V: LCSC Part Name: 2MΩ (2004) ±1%; Supplier Part: C403058; Manufacturer: PANASONIC(松下); Supplier Footprint: 0603; JLCPCB Part Class: Extended Part; Datasheet: https://atta.szlcsc.com/upload/public/pdf/source/20190709/C403058_74E29743DED2C8C628D4FC6EC64C5F92.pdf; Supplier: LCSC
R74 R99 = 201007J040KT4E: 电阻类型:厚膜电阻;阻值:400mΩ;精度:±5%;功率:750mW;最大工作电压:200V;温度系数:±800ppm/℃;; LCSC Part Name: 400mΩ ±5% 750mW 厚膜电阻; Supplier Part: C621135; Manufacturer: UNI-ROYAL(厚声); Supplier Footprint: 2010; JLCPCB Part Class: 扩展库; Datasheet: https://atta.szlcsc.com/upload/public/pdf/source/20200306/C422600_1E6D84923E4A46A82E41ADD87F860B5C.pdf; Supplier: LCSC; Type: 厚膜电阻; Tolerance: ±5%; Power(Watts): 750mW; Overload Voltage (Max): 200V; Temperature Coefficient: ±800ppm/℃; Operating Temperature Range: -55℃~+155℃
U26 = INA219AIDCNR: INA219 26V、双向、零漂移、低侧/高侧、I2C 输出电流/功率监控器; Supplier Part: C87469; Manufacturer: TI(德州仪器); Supplier Footprint: SOT-23-8; JLCPCB Part Class: 扩展库; Datasheet: https://www.ti.com/cn/lit/gpn/ina219; Supplier: LCSC
U27 = SK34_C5140034: 正向压降(Vf):550mV@3A;直流反向耐压(Vr):40V;平均整流电流(Io):3A;; LCSC Part Name: 电压:40V 电流:3A; Supplier Part: C5140034; Manufacturer: MSKSEMI(美森科); Supplier Footprint: SMA; JLCPCB Part Class: 扩展库; Datasheet: https://atta.szlcsc.com/upload/public/pdf/source/20231010/D5BADFAA775C26BADCA22E21E9DB9002.pdf; Supplier: LCSC; Forward Voltage (Vf@If): 550mV@3A; Reverse Voltage (Vr): 40V; Average Rectified Current (Io): 3A
U28 = HX3608: 功能类型:升压型;输入电压:2V~24V;输出电压:2.5V~28V;输出电流(最大值):3.5A;; Supplier Part: C296278; Manufacturer: HX(恒佳兴); Supplier Footprint: SOT-23-6L; JLCPCB Part Class: 扩展库; Datasheet: https://atta.szlcsc.com/upload/public/pdf/source/20181119/C296278_77FFD4221F60AEB235A13FC0B82FB718.pdf; Supplier: LCSC; Function: 升压型; Input Voltage: 2V~24V; Output Voltage: 2.5V~28V; Output Current (Max): 3.5A; Switching Frequency: 1.2MHz; Synchronous Rectification: 否; Number of Outputs: 1; Topology: 升压式; Switch tube (built-in/external): 内置
U29 = ME6217C33M5G: 输出类型:固定;输出极性:正;输出通道数:1;最大输入电压:7V;输出电压:3.3V;压差:180mV@(300mA);静态电流(地电流):-;输出电流:800mA;电源纹波抑制比(PRSS):65dB@(1kHz);; LCSC Part Name: Vin=7V Vout=3.3V 800mA 65dB@(1kHz); Supplier Part: C427602; Manufacturer: MICRONE(南京微盟); Supplier Footprint: SOT-23-5; JLCPCB Part Class: 扩展库; Datasheet: https://atta.szlcsc.com/upload/public/pdf/source/20190910/C427602_D4B9162A2E9D9EF57C60010DFDECEF37.pdf; Supplier: LCSC; Output Type: 固定; Output Polarity: 正; Number of Outputs: 1; Maximum Input Voltage: 7V; Output Voltage: 3.3V; Dropout Voltage: 180mV@(300mA); Output Current: 800mA; Power Supply Rejection Ratio (PRSS): 65dB@(1kHz)
U130 U141 = TP4056-42-ESOP8: 锂电池充电芯片 42代表电池满电电压4.2V。; Supplier Part: C16581; Manufacturer: TOPPOWER(南京拓微); Supplier Footprint: ESOP-8; JLCPCB Part Class: 扩展库; Datasheet: https://atta.szlcsc.com/upload/public/pdf/source/20190626/C16581_611BCF5D7CF554EAE465137A8F68DB3E.pdf; Supplier: LCSC
FPC1 FPC2 = AFC01-S08FCA-00: 间距:0.5mm;触点数量:8;锁定特性:翻盖式;安装类型:卧贴;触点类型:下接;; LCSC Part Name: 0.5mm P数:8 翻盖式 下接; Supplier Part: C262657; Manufacturer: JS(钜硕电子); Supplier Footprint: SMD,P=0.5mm; Datasheet: https://atta.szlcsc.com/upload/public/pdf/source/20180814/C262657_E4DDBFDEF95394073062C4B6399AAD54.pdf; Supplier: LCSC; Pitch: 0.5mm; Number of Contacts: 8; Locking Feature: 翻盖式; Mounting Type: 卧贴; Contact Type: 下接; Height Above Board: 2mm; FFC, FCB Thickness: 0.3mm

## Nets
3V3: C30.1 R10.2 R12.2 R13.2 U26.4(VS) U29.5(VOUT) ; also on sheet 2 4
+5V: C14.2 C27.2 D35.1 H1.1 R24.1 U5.1(V+) U6.1(V+) U7.1(V+) U27.1(K) U28.4(EN) U28.5(VIN) ; also on sheet 1 3
GND: BAT1.2 BAT2.2 C3.1 C4.2 C5.1 C6.1 C7.1 C8.2 C9.2 C10.2 C11.2 C12.2 C13.2 C14.1 C15.1 C16.2 C17.1 C18.1 C19.1 C24.1 C25.1 C26.2 C27.1 C28.1 C30.2 C40.2 C41.2 C42.2 C43.2 C44.2 C45.2 C46.2 C47.2 C48.2 C49.2 C50.2 C51.2 C52.2 C53.2 C54.2 C55.2 C56.2 C57.2 C58.2 C59.2 C60.2 C61.2 C62.2 C63.2 C64.2 C65.2 C66.2 C67.2 C68.2 C69.2 C73.1 D31.2 D32.2 D33.2 D34.2 D35.2 D36.2 FPC1.9 FPC1.10 FPC2.5 FPC2.6 FPC2.7 FPC2.8 FPC2.9 FPC2.10 FPC3.2 FPC3.3 FPC3.9 FPC3.10 FPC4.7 FPC4.8 FPC4.9 FPC4.10 FPC4.11 FPC4.12 H1.4 Q9.2(E) R17.2 R25.2 R75.2 R76.2 R100.2 R101.2 SW1.3(B2) SW1.4(B1) U2.2(GND) U2.25(EP) U5.5(GND) U5.10(#OE) U6.5(GND) U6.10(#OE) U7.5(GND) U7.10(#OE) U8.12(GND) U9.5(GND) U12.1 U17.1(VSS) U17.14(VSS) U19.4(VSS) U26.3(GND) U26.7(A0) U26.8(A1) U28.2(GND) U29.2(VSS) U130.3(GND) U130.9(EP) U141.3(GND) U141.9(EP) X2.2(GND) X2.4(GND) ; also on sheet 1 2 3 4
VBAT: C26.1 C28.2 FPC2.1 FPC2.2 FPC2.3 FPC2.4 L2.1 Q7.3(D) Q8.2(S) R21.1 U29.1(VIN) U29.3(CE) ; also on sheet 1 2
BAT+: BAT1.1 BAT2.1 D44.2(A) R22.1 U26.1(IN+)
CH32F_RST: R81.2 SW1.2(A2) U2.9(RST)
CH342_DM: U2.4(UD-) U8.3(DM3)
CH342_DP: U2.3(UD+) U8.4(DP3)
CHRG: U130.7(CHRG#) ; also on sheet 2
DM1: U7.6(HSD1-) U8.7(DM1)
DM2: U6.6(HSD1-) U8.5(DM2)
DM_CTRL: D38.1(C) R80.2 SW1.1(A1) U5.2(S)
DP1: U7.7(HSD1+) U8.8(DP1)
DP2: U6.7(HSD1+) U8.6(DP2)
DTR0: Q2.2(E) R11.1 U2.23(DTR0)
DTR1: Q4.2(E) R15.1 U2.15(DTR1)
EN: C3.2 Q1.3(C) R10.1 ; also on sheet 4
ESP32_DM: U6.8(HSD2-) U7.4(D-) ; also on sheet 4
ESP32_DP: U6.9(HSD2+) U7.3(D+) ; also on sheet 4
ESP32_TX: U5.9(HSD2+) ; also on sheet 4
EXP32_RX: U5.8(HSD2-) ; also on sheet 4
EXUSB_DM: D34.1 H1.2 U6.4(D-)
EXUSB_DP: D36.1 H1.3 U6.3(D+)
GPIO0: D2.2(A) ; also on sheet 4
GPIO1: FPC1.8 ; also on sheet 4
GPIO2: FPC1.1 ; also on sheet 4
GPIO4: U6.2(S) U7.2(S) ; also on sheet 4
GPIO5: Q8.1(G) R21.2 ; also on sheet 4
GPIO6: U9.10(#OE) U10.1 ; also on sheet 4
GPIO8: FPC1.7 ; also on sheet 4
GPIO15: FPC1.3 ; also on sheet 4
GPIO16: FPC1.4 ; also on sheet 4
GPIO17: FPC1.5 ; also on sheet 4
GPIO18: FPC1.6 ; also on sheet 4
GPIO40: U26.5(SCL) ; also on sheet 1 4
GPIO41: U26.6(SDA) ; also on sheet 1 4
GPIO45: D5.2(A) ; also on sheet 4
GPIO46: D3.2(A) ; also on sheet 4
GPIO47: FPC1.2 ; also on sheet 4
KNOB_BAT: C73.2 FPC3.1 U141.5(BAT)
KNOB_CHRG: U141.7(CHRG#) ; also on sheet 2
KNOB_POW: D38.2(A) FPC3.4 R79.1 ; also on sheet 4
KNOB_RX: FPC3.8 U5.4(D-)
KNOB_STDBY: U141.6(STDBY#) ; also on sheet 2
KNOB_TX: FPC3.7 U5.3(D+)
P_KEY: D4.1(C) ; also on sheet 2
RC_CD: U12.2 U13/NC.1 U17.11(GPIO)
RC_CLK: U17.4(CLK) U20.1
RC_CMD: U17.5(CMD) U19.5(CMD) U23.2
RC_D0: U17.3(D0) U19.6(SDD0) U22.2
RC_D1: U17.2(D1) U19.7(SDD1) U21.2
RC_D2: U14.1 U17.7(D2) U19.1(SDD2)
RC_D3: U15.1 U17.6(D3) U19.2(CD/SDD3)
RC_GVDD: C15.2 C16.1 U16.2 U17.9(VDD) U17.13(VDDA)
RC_LED: U17.12(LED) U18.1(-)
RC_VCARD: C17.2 C18.2 C19.2 U13/NC.2 U14.2 U15.2 U17.8(PMOS) U19.8(VCC) U21.1 U22.1 U23.1
RTS0: Q1.2(E) R14.1 U2.19(RTS0)
RTS1: Q3.2(E) R16.1 U2.11(RTS1)
RXD0: U2.21(TXD0) U3.1(-) ; also on sheet 4
RXD1: U2.13(TXD1) U5.6(HSD1-)
SD_DM: U9.8(HSD2-) U17.16(DM)
SD_DP: U9.9(HSD2+) U17.15(DP)
STDBY: U130.6(STDBY#) ; also on sheet 2
TXD0: U2.20(RXD0) U4.1(-) ; also on sheet 4
TXD1: U2.12(RXD1) U5.7(HSD1+)
USB_D+: D31.1 FPC4.5 U8.10(DP)
USB_D-: D33.1 FPC4.6 U8.9(DM)
VCHARGE: Q5.2(S) ; also on sheet 1
VIO: C4.1 U2.5(VIO)
VLED: C40.1 C41.1 C42.1 C43.1 C44.1 C45.1 C46.1 C47.1 C48.1 C49.1 C50.1 C51.1 C52.1 C53.1 C54.1 C55.1 C56.1 C57.1 C58.1 C59.1 C60.1 C61.1 C62.1 C63.1 C64.1 C65.1 C66.1 C67.1 C68.1 C69.1 Q8.3(D) ; also on sheet 2 3
VUSB: C6.2 C7.2 C12.1 C13.1 D32.1 D37.2(A) FPC4.1 FPC4.2 FPC4.3 FPC4.4 R18.2 R80.1 R81.1 U2.7(VDD5) U2.8(VBUS) U8.11(VDD5) U9.1(V+) U9.2(S) U10.2 U17.10(5V) ; also on sheet 2
$6N3515: C11.1 U8.14(VDD18)
$6N3516: C10.1 U8.13(VDD33)
$6N3519: U16.1 U18.2(+)
$6N3525: C9.1 U8.16(XIN) X2.1(OSC1)
$6N3526: C8.1 U8.15(XOUT) X2.3(OSC2)
$6N3558: U19.3(SCLK) U20.2
$6N15971: U8.1(DM4) U9.4(D-)
$6N15976: U8.2(DP4) U9.3(D+)
$7N1034: Q7.1(G) R19.1 R20.2
$7N1037: C29.2 Q9.3(C) R20.1 R23.2
$7N1038: C29.1 D4.2(A) R23.1
$7N9923: D5.1(C) Q9.1(B)
$7N28277: C25.2 Q7.2(S) R19.2 R22.2 U26.2(IN-) U130.5(BAT)
$7N29880: L2.2 U27.2(A) U28.1(SW)
$7N29884: R24.2 R25.1 U28.3(FB)
$7N30497: Q5.3(D) Q6.3(D)
$7N30584: Q5.1(G) Q6.1(G) R17.1 R18.1
$7N38849: R74.2 U130.4(VCC) U130.8(CE)
$7N38856: C24.2 D37.1(K) Q6.2(S) R74.1 R99.1
$7N38970: R75.1 U130.1(TEMP)
$7N39028: R76.1 U130.2(PROG)
$7N45600: R99.2 U141.4(VCC) U141.8(CE)
$7N45602: R100.1 U141.1(TEMP)
$7N45603: R101.1 U141.2(PROG)
$8N720: C5.2 U2.6(V3)
$8N2827: Q3.1(B) R15.2
$8N2829: Q4.1(B) R16.2
$8N3507: Q1.1(B) R11.2
$8N3513: D2.1(C) D3.1(C) Q2.3(C)
$8N3515: Q2.1(B) R14.2
$8N3896: R12.1 U3.2(+)
$8N3898: R13.1 U4.2(+)
$8N9580: FPC3.5 Q4.3(C)
$8N9591: FPC3.6 Q3.3(C)
$8N19659: D43.1(C) R79.2
$8N19700: D43.2(A) D44.1(C)

Not connected (* = marked no-connect by the designer): U2 1(RI0)* 10(CTS1)* 14(DSR1)* 16(DCD1)* 17(RI1)* 18(CTS0)* 22(DSR0)* 24(DCD0)*; U7 8(HSD2-)* 9(HSD2+)*; U9 6(HSD1-)* 7(HSD1+)*; U28 6(NC)*; U29 4(NC)*
